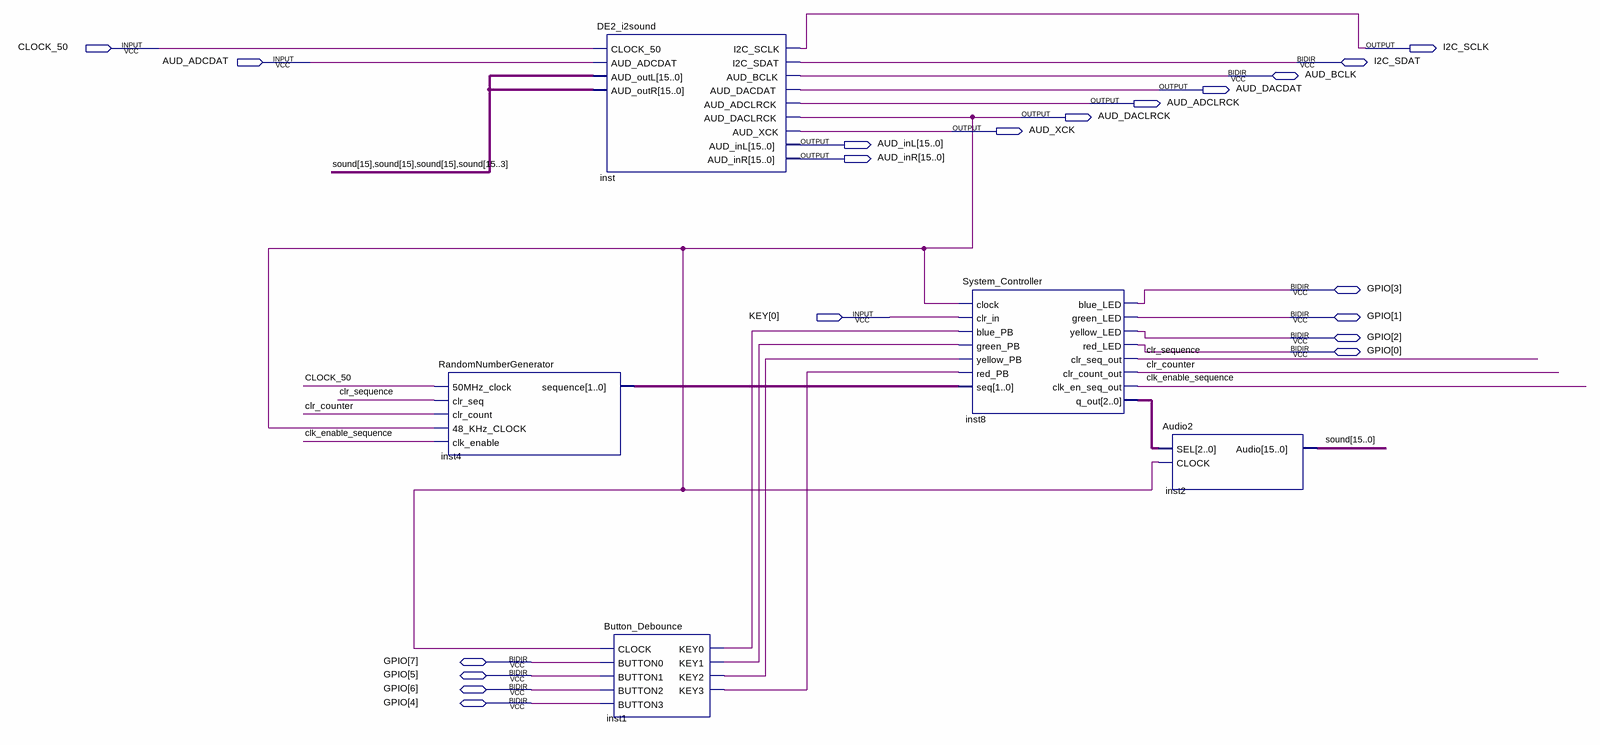
[diagram p0: schematic sheet]
// Quartus schematic CODEC.bdf as structural Verilog: 5 symbols, 20 pins
module CODEC (
  input  CLOCK_50,
  input  AUD_ADCDAT,
  input  [0:0] KEY,
  inout  I2C_SDAT,
  inout  AUD_BCLK,
  inout  [7:0] GPIO,
  output I2C_SCLK,
  output AUD_DACDAT,
  output AUD_ADCLRCK,
  output AUD_DACLRCK,
  output AUD_XCK,
  output [15:0] AUD_inL,
  output [15:0] AUD_inR
);

  wire clk_enable_sequence, clr_counter, clr_sequence, inst1_key0, inst1_key1, inst1_key2, inst1_key3;
  wire [1:0] inst4_sequence;
  wire [2:0] inst8_q_out;
  wire [15:0] sound;

  RandomNumberGenerator inst4 (
    .\50MHz_clock (CLOCK_50), .clr_seq(clr_sequence), .clr_count(clr_counter), .\48_KHz_CLOCK (AUD_DACLRCK),
    .clk_enable(clk_enable_sequence), .\sequence (inst4_sequence));
  DE2_i2sound inst (
    .CLOCK_50(CLOCK_50), .AUD_ADCDAT(AUD_ADCDAT), .AUD_outL({{4{sound[15]}}, sound[14:3]}),
    .AUD_outR({{4{sound[15]}}, sound[14:3]}), .I2C_SCLK(I2C_SCLK), .AUD_DACDAT(AUD_DACDAT),
    .AUD_ADCLRCK(AUD_ADCLRCK), .AUD_DACLRCK(AUD_DACLRCK), .AUD_XCK(AUD_XCK), .AUD_inL(AUD_inL),
    .AUD_inR(AUD_inR), .I2C_SDAT(I2C_SDAT), .AUD_BCLK(AUD_BCLK));
  Button_Debounce inst1 (
    .CLOCK(AUD_DACLRCK), .BUTTON0(GPIO[7]), .BUTTON1(GPIO[5]), .BUTTON2(GPIO[6]), .BUTTON3(GPIO[4]),
    .KEY0(inst1_key0), .KEY1(inst1_key1), .KEY2(inst1_key2), .KEY3(inst1_key3));
  System_Controller inst8 (
    .clock(AUD_DACLRCK), .clr_in(KEY[0]), .blue_PB(inst1_key0), .green_PB(inst1_key1),
    .yellow_PB(inst1_key2), .red_PB(inst1_key3), .seq(inst4_sequence), .blue_LED(GPIO[3]),
    .green_LED(GPIO[1]), .yellow_LED(GPIO[2]), .red_LED(GPIO[0]), .clr_seq_out(clr_sequence),
    .clr_count_out(clr_counter), .clk_en_seq_out(clk_enable_sequence), .q_out(inst8_q_out));
  Audio2 inst2 (.SEL(inst8_q_out), .CLOCK(AUD_DACLRCK), .Audio(sound));
endmodule
